# EAGLE design ICE_mod_microsd (EAGLE 5.06)
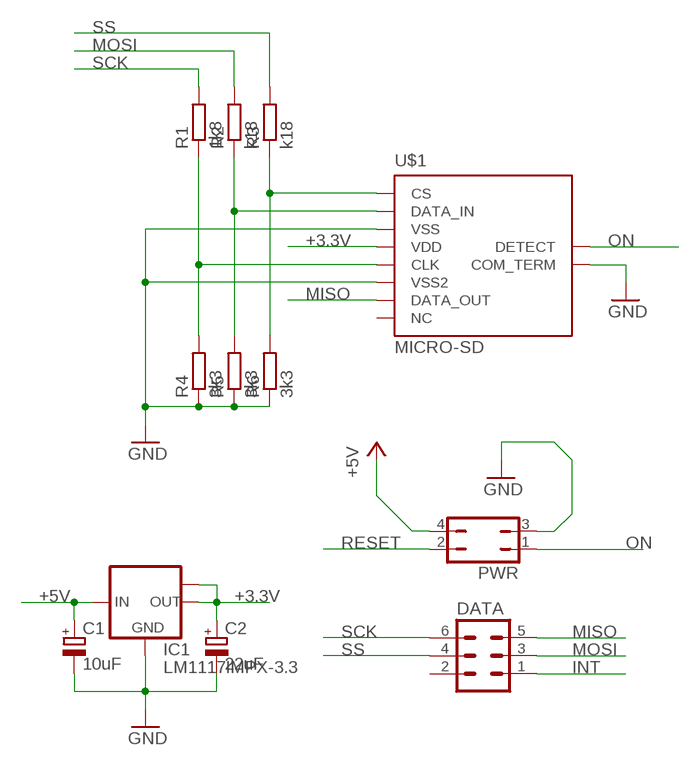
[diagram p0: schematic, sheet 1]

## Parts
C1  10uF  CPOL-EUE2.5-5  [E2,5-5]
C2  22uF  CPOL-EUE2.5-5  [E2,5-5]
DATA  MA03-2  [MA03-2]
IC1  LM1117IMPX-3.3  [SOT223]
PWR  JP2Q  [JP2Q]
R1  1k8  R-EU_R0805  [R0805]
R2  k18  R-EU_R0805  [R0805]
R3  k18  R-EU_R0805  [R0805]
R4  3k3  R-EU_R0805  [R0805]
R5  3k3  R-EU_R0805  [R0805]
R6  3k3  R-EU_R0805  [R0805]
U$1  MICRO-SD  [MICRO-SD]

## Nets
+3.3V: C2.+ IC1.2(OUT) IC1.TAB(OUT1) U$1.4(VDD)
+5V: C1.+ IC1.3(IN) PWR.4
CLK: R1.1 R4.2 U$1.5(CLK)
CS: R3.1 R6.2 U$1.1(CS)
DATA_IN: R2.1 R5.2 U$1.2(DATA_IN)
GND: C1.- C2.- IC1.1(GND) PWR.3 R4.1 R5.1 R6.1 U$1.3(VSS) U$1.6(VSS2) U$1.9(COM_TERM)
INT: DATA.1
MISO: DATA.5 U$1.7(DATA_OUT)
MOSI: DATA.3 R2.2
ON: PWR.1 U$1.10(DETECT)
RESET: PWR.2
SCK: DATA.6 R1.2
SS: DATA.4 R3.2
Unconnected: DATA.2 U$1.8(NC)

## Library data of the parts
C1 C2 = rcl:CPOL-EU: POLARIZED CAPACITOR, European symbol
DATA = con-lstb:MA03-2: PIN HEADER
IC1 = lm1117:LM1117IMPX-*
PWR = jumper:JP2Q: JUMPER
R1-R6 = rcl:R-EU_: RESISTOR, European symbol
U$1 = KYOCERA:MICRO-SD

## Board
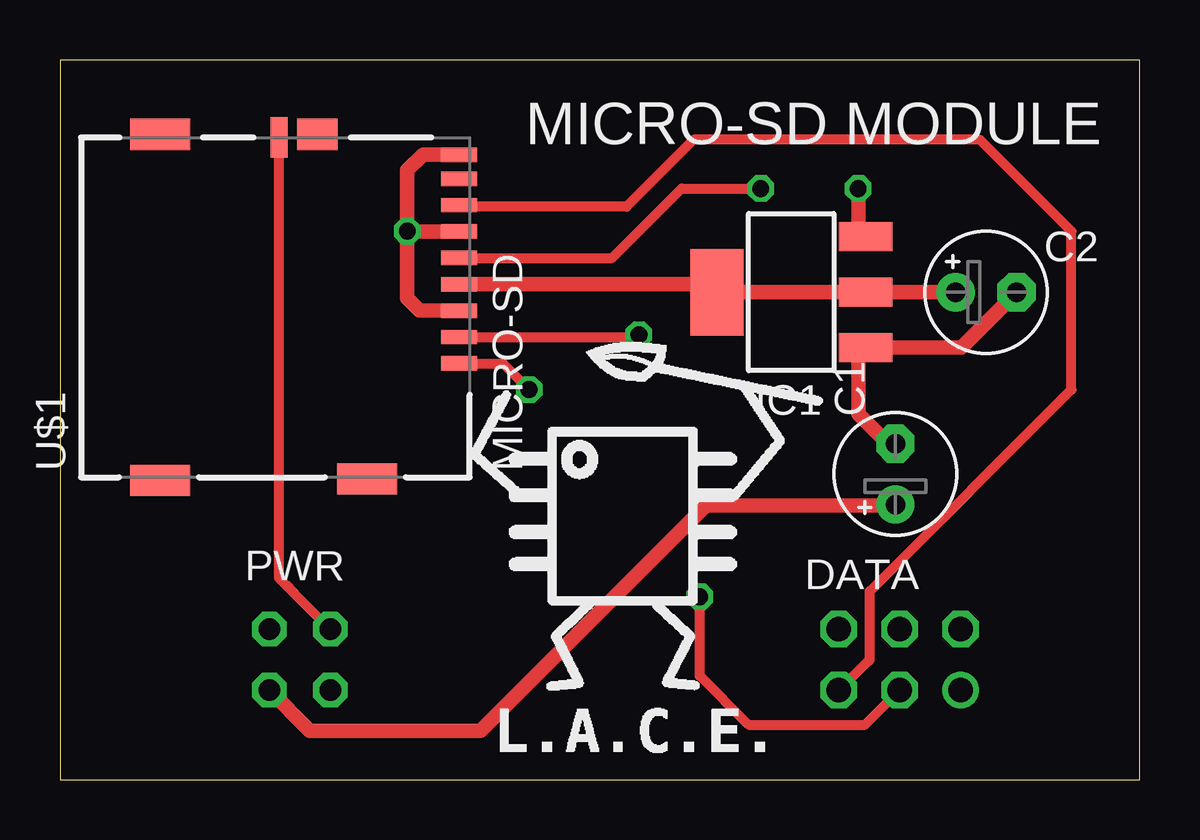
[diagram p1: board, top side]
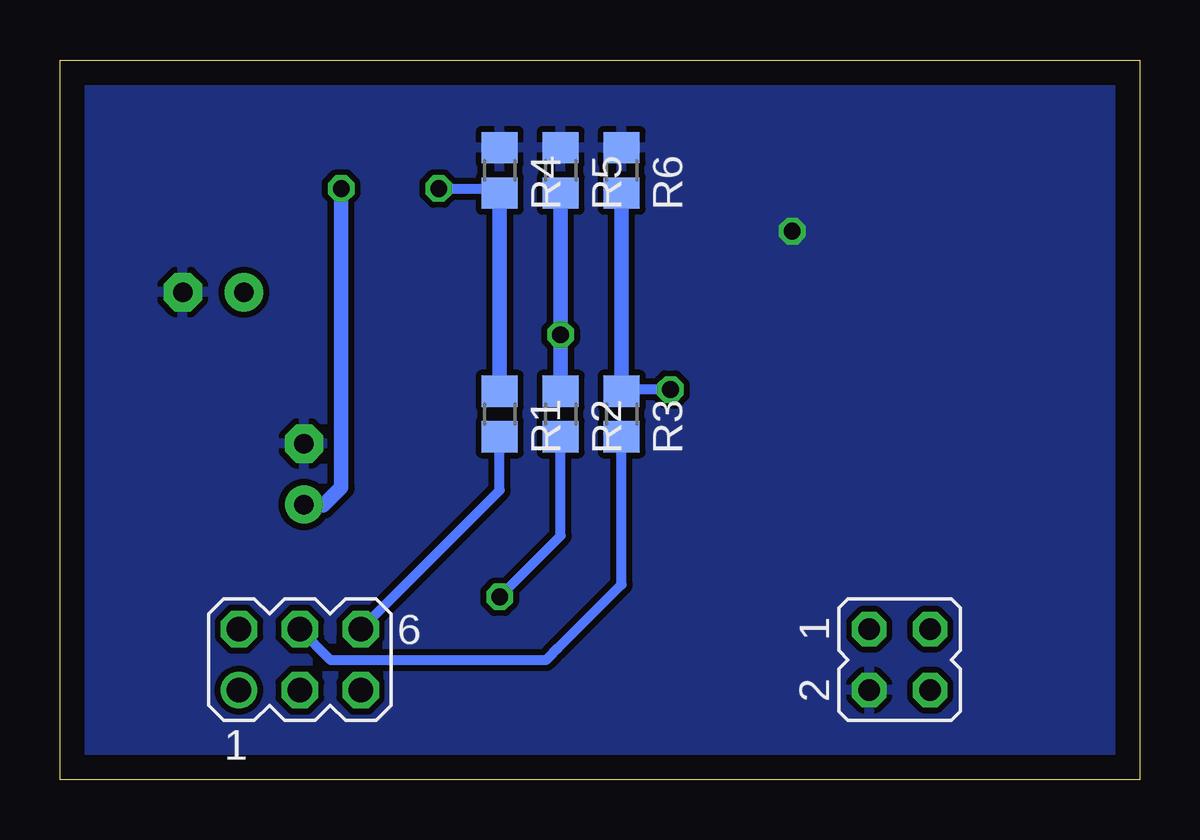
[diagram p2: board, bottom side, seen from below]

Size 45 x 30 mm. Coordinates in mm from the lower left corner, seen from the top.
Outline: 0,0 45,0 45,30 0,30 0,0
Copper layers (1*16): Top 0.035mm / dielectric 1.5mm / Bottom 0.035mm
Design rules "olimex-10mils *": minimum track width 16mil, minimum drill 24mil, track to track 10mil, track to pad 10mil, pad to pad 10mil, via to via 10mil, smd to smd 10mil, copper to edge 40mil, drill to drill 10mil, minimum pad ring 10mil, minimum via ring 8mil, stop-mask expansion 0mil, vias tented up to drill 0mil, thermal gap 10mil

### Footprints (pad centres in the part's own frame; a part is rotated, then mirrored left to right if it is on the bottom)
E2,5-5 = drill 0.813 pad 1.6 round: + -1.27,0 | drill 0.813 pad 1.6 octagon: - 1.27,0
MA03-2 = drill 1.016 round: 1 -2.54,-1.27 | drill 1.016 octagon: 2 -2.54,1.27; 3 0,-1.27; 4 0,1.27; 5 2.54,-1.27; 6 2.54,1.27
SOT223 = smd 1.219 x 2.235: 1 -2.311,-3.099; 2 0,-3.099; 3 2.311,-3.099 | smd 3.6 x 2.2: TAB 0,3.099
JP2Q = drill 0.914 octagon: 1 -1.27,-1.27; 2 -1.27,1.27; 3 1.27,-1.27; 4 1.27,1.27
R0805 = smd 1.3 x 1.5: 1 -0.95,0; 2 0.95,0
MICRO-SD = smd 0.6 x 1.5: 1 -4.4,-7.5; 2 -3.3,-7.5; 3 -2.2,-7.5; 4 -1.1,-7.5; 5 0,-7.5; 6 1.1,-7.5; 7 2.2,-7.5; 8 3.3,-7.5; 9 4.3,-7.5 | smd 1.7 x 0.7: 10 5.02,0 | smd 1.3 x 2.5: 11 -9.28,4.95; 12 5.15,4.95; 13 -9.22,-3.67 | smd 1.3 x 1.7: 14 5.15,-1.6

### Placement (x,y rotation side)
C1  34.82,12.74 90 top
C2  38.61,20.32 0 top
DATA  35,5 0 bottom
IC1  30.48,20.32 90 top
PWR  10,5 270 bottom
R1  26.67,15.24 270 bottom
R2  24.13,15.24 270 bottom
R3  21.59,15.24 270 bottom
R4  26.67,25.4 270 bottom
R5  24.13,25.4 270 bottom
R6  21.59,25.4 270 bottom
U$1  9.13,21.75 90 top

### Tracks (layer width: path | path; a pad name or v marks a point on that pad's centre or on a via)
+3.3V
  Top 0.406: IC1.TAB 28.19,20.32 27.86,20.65
  Top 0.61: C2.+ IC1.2 28.19,20.32 | U$1.4 27.86,20.65
+5V  (via drill 0.7)
  Top 0.406: IC1.3 33.78,22.61
  Top 0.61: PWR.4 8.73,3.72 10.41,2.03 17.53,2.03 26.92,11.43 34.82,11.43 C1.+ | v33.27,24.64 33.27,22.94 IC1.3
  Bottom 0.61: v33.27,24.64 33.27,12.18 34.02,11.43 34.78,11.43 C1.+
CLK  (via drill 0.7)
  Top 0.406: U$1.5 23.02,21.75 25.72,24.45 25.91,24.64 v29.21,24.64
  Bottom 0.406: v29.21,24.64 26.86,24.64 R4.2
  Bottom 0.61: R4.2 R1.1
CS  (via drill 0.7)
  Top 0.406: U$1.1 18.46,17.35 v19.56,16.26
  Bottom 0.406: v19.56,16.26 21.52,16.26 R3.1
  Bottom 0.61: R3.1 R6.2
DATA_IN  (via drill 0.7)
  Top 0.406: U$1.2 24.04,18.45 v24.13,18.54
  Bottom 0.61: R2.1 v24.13,18.54 R5.2
GND  (via drill 0.7)
  Top 0.406: v14.48,22.86 v14.49,22.85
  Top 0.61: U$1.3 14.99,19.55 14.48,20.07 v14.48,22.86 14.48,25.4 15.13,26.05 U$1.9 | v14.49,22.85 U$1.6 | IC1.1 37.57,18.01 C2.- | 33.27,18.03 33.27,15.24 34.51,14.01 C1.-
  pour Bottom (isolate 0.254): 0,30.48 0,0 44.45,0 45.72,0 45.72,30.48
MISO
  Top 0.406: U$1.7 16.94,23.95 17.02,23.88 23.62,23.88 26.42,26.67 38.35,26.67 42.16,22.86 42.16,16.26 33.76,7.85 33.76,4.98 33.71,4.93 33.68,4.93 32.48,3.73 DATA.5
MOSI  (via drill 0.7)
  Top 0.406: v26.67,7.62 26.67,4.32 28.7,2.29 33.56,2.29 DATA.3
  Bottom 0.406: R2.2 24.13,10.16 v26.67,7.62
ON
  Top 0.406: 9.78,7.75 11.18,6.35 PWR.1 | 9.78,7.75 9.4,8.13 | U$1.10 9.14,26.67 9.14,8.38 9.78,7.75
SCK
  Bottom 0.406: R1.2 26.67,12.06 DATA.6
SS
  Bottom 0.406: DATA.4 33.71,4.98 24.74,4.98 24.26,5.46 | R3.2 21.59,8.13 24.26,5.46 | 24.26,5.46 24.64,5.08

### Text on the board
tNames: MICRO-SD MODULE